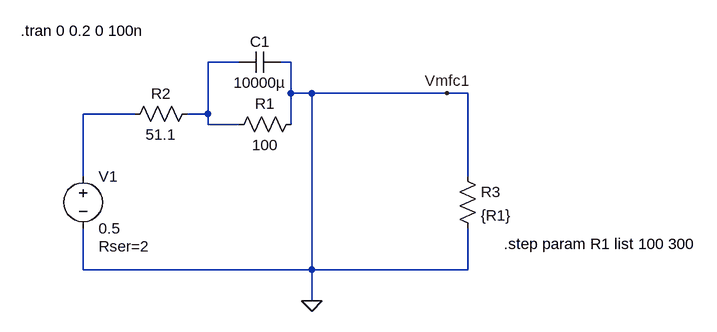
[diagram p0: schematic mfcs.asc]
mfcs.asc, the LTspice schematic file:
Version 4
SHEET 1 880 680
WIRE 96 -128 48 -128
WIRE 176 -128 160 -128
WIRE 176 -80 176 -128
WIRE 208 -80 176 -80
WIRE 416 -80 208 -80
WIRE 448 -80 416 -80
WIRE -64 -48 -144 -48
WIRE 48 -48 48 -128
WIRE 48 -48 16 -48
WIRE 48 -32 48 -48
WIRE 96 -32 48 -32
WIRE 176 -32 176 -80
WIRE -144 48 -144 -48
WIRE 448 48 448 -80
WIRE -144 192 -144 128
WIRE 208 192 208 -80
WIRE 208 192 -144 192
WIRE 448 192 448 128
WIRE 448 192 208 192
WIRE 208 240 208 192
FLAG 208 240 0
FLAG 416 -80 Vmfc1
SYMBOL cap 160 -144 R90
WINDOW 0 0 32 VBottom 2
WINDOW 3 32 32 VTop 2
SYMATTR InstName C1
SYMATTR Value 10000µ
SYMBOL res 192 -48 R90
WINDOW 0 0 56 VBottom 2
WINDOW 3 32 56 VTop 2
SYMATTR InstName R1
SYMATTR Value 100
SYMBOL res 32 -64 R90
WINDOW 0 0 56 VBottom 2
WINDOW 3 32 56 VTop 2
SYMATTR InstName R2
SYMATTR Value 51.1
SYMBOL res 432 32 R0
SYMATTR InstName R3
SYMATTR Value {R1}
SYMBOL voltage -144 32 R0
WINDOW 123 0 0 Left 2
WINDOW 39 24 124 Left 2
SYMATTR InstName V1
SYMATTR Value 0.5
SYMATTR SpiceLine Rser=2
TEXT 504 152 Left 2 !.step param R1 list 100 300
TEXT -240 -176 Left 2 !.tran 0 0.2 0 100n

The netlist it stands for:
* mfcs.asc
C1 0 N001 10000µ
R1 0 N001 100
R2 N001 N002 51.1
R3 0 0 {R1}
V1 N002 0 0.5 Rser=2
.step param R1 list 100 300
.tran 0 0.2 0 100n
.backanno
.end